# Altium project Conditioning_Chamber_Controller.PrjPcb
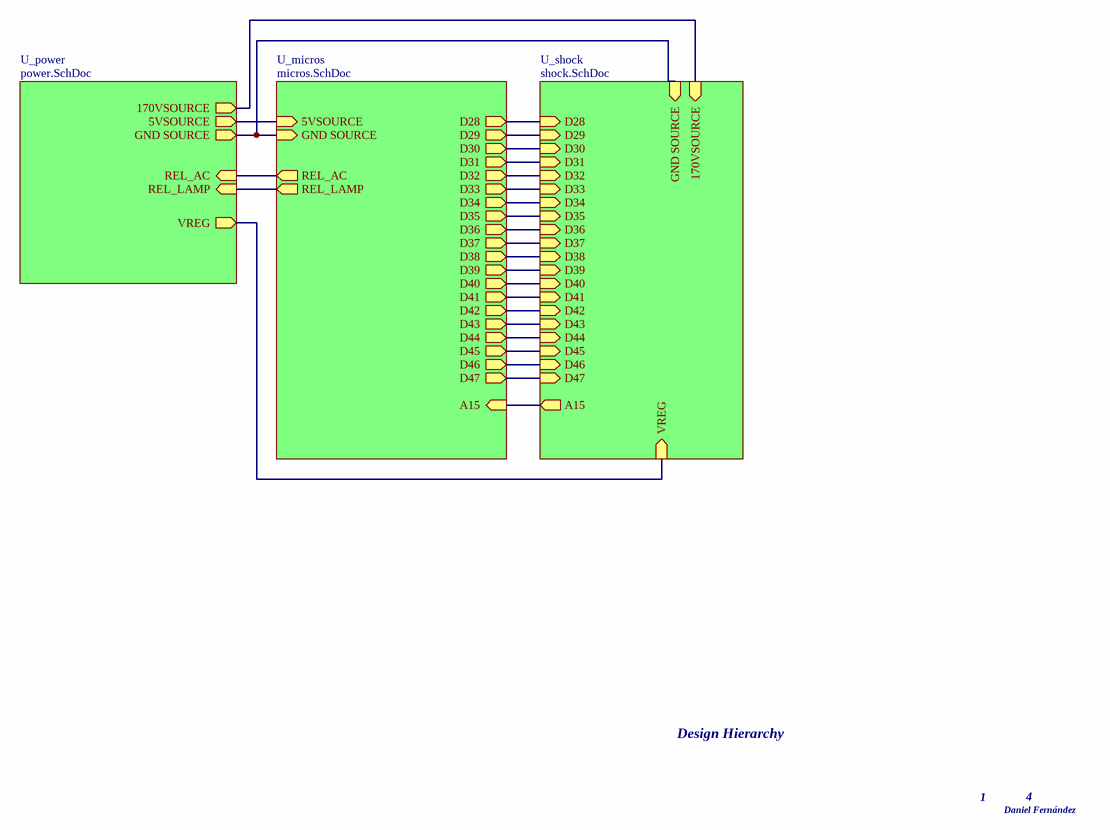
[diagram p0: main.SchDoc]
4 sheets, 83 parts. Net scope: hierarchical (ports join the sheet entries above them; power ports are global).
Board file: main.PcbDoc
Sheets:
  main.SchDoc
    U_power = power.SchDoc
    U_micros = micros.SchDoc
    U_shock = shock.SchDoc

## Sheet main.SchDoc
size Letter

### Sub-sheets
U_micros = micros.SchDoc: GND SOURCE (in), 5VSOURCE (in), REL_AC (out), REL_LAMP (out), D28 (out), D29 (out), D30 (out), D31 (out), D32 (out), D33 (out), D34 (out), D35 (out), D36 (out), D37 (out), D38 (out), D39 (out), D40 (out), D41 (out), D42 (out), D43 (out), D44 (out), D45 (out), D46 (out), D47 (out), A15 (in)
U_power = power.SchDoc: REL_AC (in), REL_LAMP (in), 5VSOURCE (out), 170VSOURCE (out), GND SOURCE (out), VREG (out)
U_shock = shock.SchDoc: D28 (in), GND SOURCE (in), D29 (in), D30 (in), D31 (in), D32 (in), D33 (in), D34 (in), D35 (in), D36 (in), D37 (in), D38 (in), D39 (in), D40 (in), D41 (in), D42 (in), D43 (in), D44 (in), D45 (in), D46 (in), D47 (in), 170VSOURCE (in), A15 (out), VREG (in)

### Nets
+5VDC: sheet U_power/5VSOURCE, sheet U_micros/5VSOURCE
+170VDC: sheet U_power/170VSOURCE, sheet U_shock/170VSOURCE
+VREG: sheet U_power/VREG, sheet U_shock/VREG
GND: sheet U_power/GND SOURCE, sheet U_micros/GND SOURCE, sheet U_shock/GND SOURCE
NetJ11_1: sheet U_micros/A15, sheet U_shock/A15
NetO1_1: sheet U_micros/D28, sheet U_shock/D28
NetO2_1: sheet U_micros/D29, sheet U_shock/D29
NetO3_1: sheet U_micros/D30, sheet U_shock/D30
NetO4_1: sheet U_micros/D31, sheet U_shock/D31
NetO5_1: sheet U_micros/D32, sheet U_shock/D32
NetO6_1: sheet U_micros/D33, sheet U_shock/D33
NetO7_1: sheet U_micros/D34, sheet U_shock/D34
NetO8_1: sheet U_micros/D35, sheet U_shock/D35
NetO9_1: sheet U_micros/D36, sheet U_shock/D36
NetO10_1: sheet U_micros/D37, sheet U_shock/D37
NetO11_1: sheet U_micros/D38, sheet U_shock/D38
NetO12_1: sheet U_micros/D39, sheet U_shock/D39
NetO13_1: sheet U_micros/D40, sheet U_shock/D40
NetO14_1: sheet U_micros/D41, sheet U_shock/D41
NetO15_1: sheet U_micros/D42, sheet U_shock/D42
NetO16_1: sheet U_micros/D43, sheet U_shock/D43
NetO17_1: sheet U_micros/D44, sheet U_shock/D44
NetO18_1: sheet U_micros/D45, sheet U_shock/D45
NetO19_1: sheet U_micros/D46, sheet U_shock/D46
NetO20_1: sheet U_micros/D47, sheet U_shock/D47
NetR3_1: sheet U_power/REL_AC, sheet U_micros/REL_AC
NetR4_1: sheet U_power/REL_LAMP, sheet U_micros/REL_LAMP

### Notes on the sheet
- Design Hierarchy
- 1
- Daniel Fernández
- 4
- Title
- Size:
- Date:
- Letter
- Number:
- Time:
- Revision:
- Sheet
- of
- File:

## Sheet power.SchDoc
size Letter
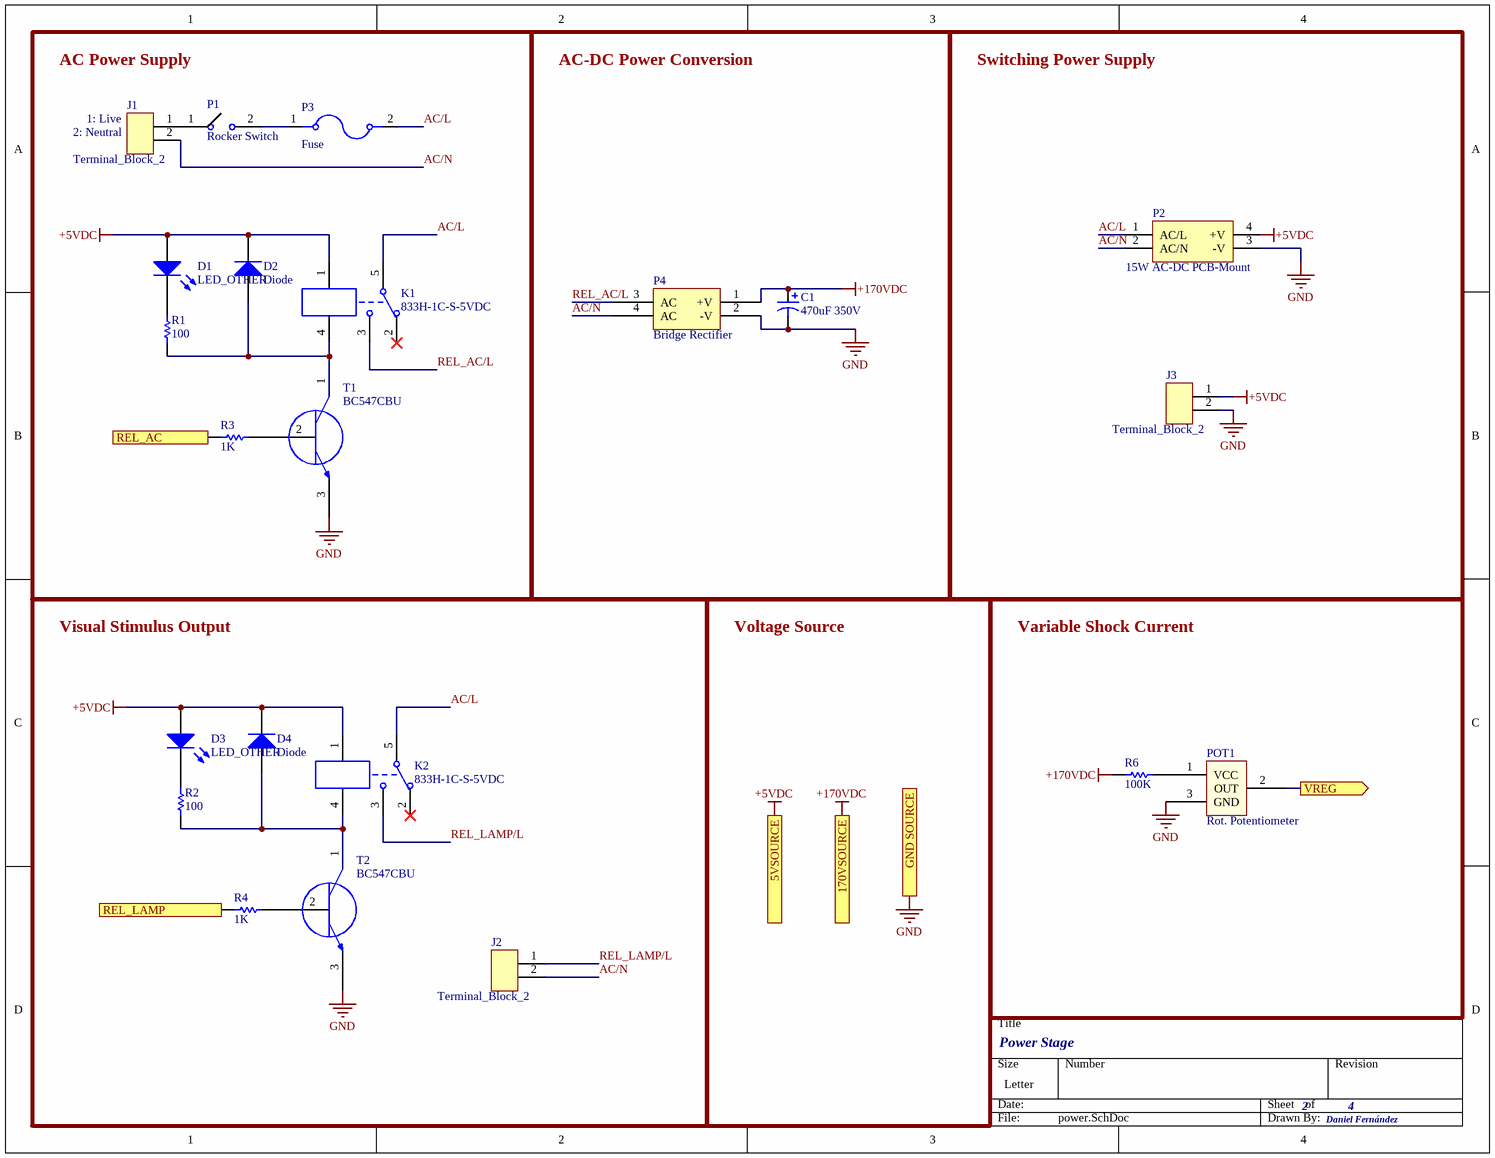
[diagram p1: power.SchDoc]

### Parts
C1  470uF 350V  [ESMQ351VSN471MR35S]
D1  LED_OTHER  [LED_AXIAL]
D2  Diode  [Diodo 1N4007 Rectificador]
D3  LED_OTHER  [LED_AXIAL]
D4  Diode  [Diodo 1N4007 Rectificador]
J1  Terminal_Block_2  [Terminal_Block_2]
J2  Terminal_Block_2  [Terminal_Block_2]
J3  Terminal_Block_2  [Terminal_Block_2]
K1  833H-1C-S-5VDC  [Relay_833H]
K2  833H-1C-S-5VDC  [Relay_833H]
P1  Rocker Switch  [Rocker Switch]
P2  15W AC-DC PCB-Mount  [15W AC-DC PCB-Mount]
P3  Fuse  [Fuse Holder]
P4  Bridge Rectifier  [KBPC1010]
POT1  Rot. Potentiometer  [PTV09A-4020F-B504]
R1  100  [RESISTOR]
R2  100  [RESISTOR]
R3  1K  [RESISTOR]
R4  1K  [RESISTOR]
R6  100K  [RESISTOR]
T1  BC547CBU  [BC547CBU]
T2  BC547CBU  [BC547CBU]

### Blocks framed on the sheet
AC Power Supply: D1 D2 J1 K1 P1 P3 R1 R3 T1
AC-DC Power Conversion: C1 P4
Switching Power Supply: J3 P2
Visual Stimulus Output: D3 D4 J2 K2 R2 R4 T2
Variable Shock Current: POT1 R6

### Ports
5VSOURCE (out), 170VSOURCE (out), GND SOURCE (out), REL_AC (in), REL_LAMP (in), VREG (out)

### Nets
+5VDC: D1.1(A) D2.2(C) D3.1(A) D4.2(C) J3.1 K1.1 K2.1 P2.4(+V) ; port 5VSOURCE
+170VDC: C1.1 P4.1(+V) R6.1 ; port 170VSOURCE
+VREG: POT1.2(OUT) ; port VREG
GND: C1.2 J3.2 P2.3(-V) P4.2(-V) POT1.3(GND) T1.3(E) T2.3(E) ; port GND SOURCE
AC/L: K1.5 K2.5 P2.1(AC/L) P3.2
AC/N: J1.2 J2.2 P2.2(AC/N) P4.4(AC)
REL_AC/L: K1.3(NO) P4.3(AC)
REL_LAMP/L: J2.1 K2.3(NO)
NetD1_2: D1.2(K) R1.2
NetD2_1: D2.1(A) K1.4 R1.1 T1.1(C)
NetD3_2: D3.2(K) R2.2
NetD4_1: D4.1(A) K2.4 R2.1 T2.1(C)
NetJ1_1: J1.1 P1.1
NetP1_2: P1.2 P3.1
NetPOT1_1: POT1.1(VCC) R6.2
NetR3_1: R3.1 ; port REL_AC
NetR3_2: R3.2 T1.2(B)
NetR4_1: R4.1 ; port REL_LAMP
NetR4_2: R4.2 T2.2(B)

Not connected (* = marked no-connect by the designer): K1 2(NC)*; K2 2(NC)*

### Notes on the sheet
- (near J1) 2: Neutral
- (near J1) 1: Live
- Voltage Source
- Power Stage
- 2
- Daniel Fernández
- 4
- Title
- Size:
- Date:
- Letter
- Number:
- Time:
- Revision:
- Sheet
- of
- File:

### Library data of the parts
C1 = Capacitor_AXIAL_Pol: Manufacturer: *; Manufacturer Code: *
D1 D3 = LED_OTHER: Typical RED GaAs LED; Published: 8-Jun-2000; LatestRevisionDate: 08-Jul-2005; LatestRevisionNote: Mech Layer 1 removed.; PackageReference: LED-1; Publisher: Altium Limited; PackageDescription: LED; 2 Leads
D2 D4 = Diode: Default Diode; Published: 8-Jun-2000; LatestRevisionDate: 17-Jul-2002; LatestRevisionNote: Re-released for DXP Platform.; PackageVersion: Sep-1996; PackageReference: SMC; Publisher: Altium Limited; PackageDescription: DO-214-AB/SMC; 2 C-Bend Leads; Body 7.9 x 5.9 mm, inc. leads (LxW); Code_JEDEC: DO-214-AB
K1 K2 = Relay_Song 5V: Relay Song Chuan 5V; Manufacturer: Song Chuan; Manufacturer Code: 833H-1C-S-5VDC; HelpURL: C:\Varios\PERCRO_DATASHEET\Relay_833H.pdf
P4 = KBPC1010: Single-Phase Silicon Bridge Rectifier Rectifier
POT1 = ROT_POT: Rotatory Potentiometer
R1-R4 R6 = Resistor_Axial: Published: 8-Jun-2000; LatestRevisionDate: 17-Jul-2002; LatestRevisionNote: Re-released for DXP Platform.; PackageReference: AXIAL-0.3; Publisher: Altium Limited; PackageDescription: Axial Device, Thru-Hole; 2 Leads; 0.3 in Pin Spacing

## Sheet micros.SchDoc: Microcontrollers Stage
size Letter; Author: Daniel Fernández; CompanyName: UAEMéx; DrawnBy: Daniel Fernández; Engineer: Daniel Fernández; Organization: UAEMéx; SheetNumber: 2; SheetTotal: 3; ImagePath: C:\Users\xsteg\Desktop\Logo_de_la_UAEMex.svg
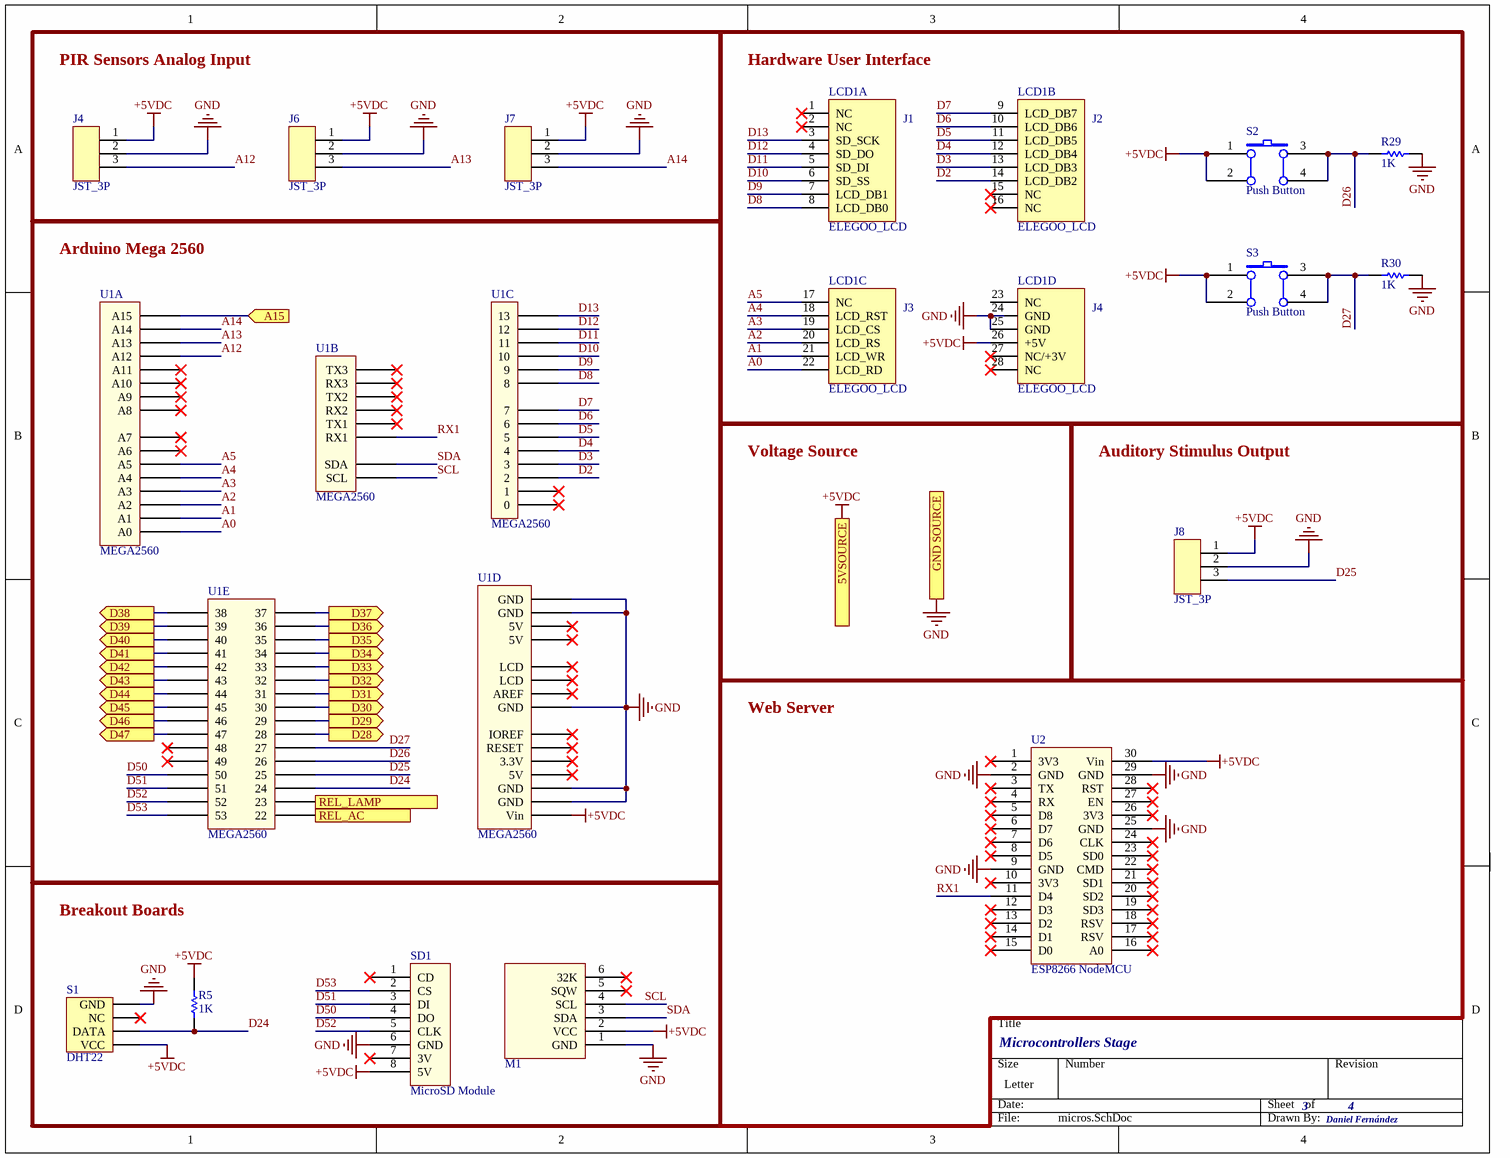
[diagram p2: micros.SchDoc]

### Parts
J4  JST_3P  [JST_3P_ANGLE]
J6  JST_3P  [JST_3P_ANGLE]
J7  JST_3P  [JST_3P_ANGLE]
J8  JST_3P  [JST_3P_ANGLE]
LCD1  ELEGOO_LCD  [Elegoo_LCD]  (parts A,B,C,D of 4)
M1  DS3231  [DS3231_HORIZONTAL]  (value not drawn)
R5  1K  [RESISTOR]
R29  1K  [RESISTOR]
R30  1K  [RESISTOR]
S1  DHT22  [DHT22]
S2  Push Button  [PUSH_BUTTON]
S3  Push Button  [PUSH_BUTTON]
SD1  MicroSD Module  [Micro-SD]
U1  MEGA2560  [MEGA2560_Inv]  (parts A,B,C,D,E of 5)
U2  ESP8266 NodeMCU  [ESP8266_NodeMCU]

### Blocks framed on the sheet
PIR Sensors Analog Input: J4 J6 J7
Hardware User Interface: LCD1 R29 R30 S2 S3
Arduino Mega 2560: U1
Auditory Stimulus Output: J8
Breakout Boards: M1 R5 S1 SD1

### Ports
5VSOURCE (in), A15 (in), D28 (out), D29 (out), D30 (out), D31 (out), D32 (out), D33 (out), D34 (out), D35 (out), D36 (out), D37 (out), D38 (out), D39 (out), D40 (out), D41 (out), D42 (out), D43 (out), D44 (out), D45 (out), D46 (out), D47 (out), GND SOURCE (in), REL_AC (out), REL_LAMP (out)

### Nets
+5VDC: J4.1 J6.1 J7.1 J8.1 LCD1.26(+5V) M1.2(VCC) R5.1 S1.1(VCC) S2.1 S2.2 S3.1 S3.2 SD1.8(5V) U1.Vin U2.30(Vin) ; port 5VSOURCE
GND: J4.2 J6.2 J7.2 J8.2 LCD1.24(GND) LCD1.25(GND) M1.1(GND) R29.2 R30.2 S1.4(GND) SD1.6(GND) U1.GND U1.GND_1(GND) U1.GND_2(GND) U1.GND_3(GND) U1.GND_4(GND) U2.2(GND) U2.9(GND) U2.25(GND) U2.29(GND) ; port GND SOURCE
A0: LCD1.22(LCD_RD) U1.A0
A1: LCD1.21(LCD_WR) U1.A1
A2: LCD1.20(LCD_RS) U1.A2
A3: LCD1.19(LCD_CS) U1.A3
A4: LCD1.18(LCD_RST) U1.A4
A5: LCD1.17(NC) U1.A5
A12: J4.3 U1.A12
A13: J6.3 U1.A13
A14: J7.3 U1.A14
D2: LCD1.14(LCD_DB2) U1.2
D3: LCD1.13(LCD_DB3) U1.3
D4: LCD1.12(LCD_DB4) U1.4
D5: LCD1.11(LCD_DB5) U1.5
D6: LCD1.10(LCD_DB6) U1.6
D7: LCD1.9(LCD_DB7) U1.7
D8: LCD1.8(LCD_DB0) U1.8
D9: LCD1.7(LCD_DB1) U1.9
D10: LCD1.6(SD_SS) U1.10
D11: LCD1.5(SD_DI) U1.11
D12: LCD1.4(SD_DO) U1.12
D13: LCD1.3(SD_SCK) U1.13
D24: R5.2 S1.2(DATA) U1.24
D25: J8.3 U1.25
D26: R29.1 S2.3 S2.4 U1.26
D27: R30.1 S3.3 S3.4 U1.27
D50: SD1.4(DO) U1.50
D51: SD1.3(DI) U1.51
D52: SD1.5(CLK) U1.52
D53: SD1.2(CS) U1.53
RX1: U1.RX1 U2.11(D4)
SCL: M1.4(SCL) U1.SCL
SDA: M1.3(SDA) U1.SDA
NetJ11_1: U1.A15 ; port A15
NetO1_1: U1.28 ; port D28
NetO2_1: U1.29 ; port D29
NetO3_1: U1.30 ; port D30
NetO4_1: U1.31 ; port D31
NetO5_1: U1.32 ; port D32
NetO6_1: U1.33 ; port D33
NetO7_1: U1.34 ; port D34
NetO8_1: U1.35 ; port D35
NetO9_1: U1.36 ; port D36
NetO10_1: U1.37 ; port D37
NetO11_1: U1.38 ; port D38
NetO12_1: U1.39 ; port D39
NetO13_1: U1.40 ; port D40
NetO14_1: U1.41 ; port D41
NetO15_1: U1.42 ; port D42
NetO16_1: U1.43 ; port D43
NetO17_1: U1.44 ; port D44
NetO18_1: U1.45 ; port D45
NetO19_1: U1.46 ; port D46
NetO20_1: U1.47 ; port D47
NetR3_1: U1.22 ; port REL_AC
NetR4_1: U1.23 ; port REL_LAMP

Not connected (* = marked no-connect by the designer): LCD1 1(NC)* 2(NC)* 15(NC)* 16(NC)* 23(NC) 27(NC/+3V)* 28(NC)*; M1 5(SQW)* 6(32K)*; S1 3(NC)*; SD1 1(CD)* 7(3V)*; U1 0* 1* 3.3V* 5V* 5V_1(5V)* 5V_2(5V)* 48* 49* A6* A7* A8* A9* A10* A11* AREF* IOREF* LCD* LCD_1(LCD)* RESET* RX2* RX3* TX1* TX2* TX3*; U2 1(3V3)* 3(TX)* 4(RX)* 5(D8)* 6(D7)* 7(D6)* 8(D5)* 10(3V3)* 12(D3)* 13(D2)* 14(D1)* 15(D0)* 16(A0)* 17(RSV)* 18(RSV)* 19(SD3)* 20(SD2)* 21(SD1)* 22(CMD)* 23(SD0)* 24(CLK)* 26(3V3)* 27(EN)* 28(RST)*

### Notes on the sheet
- Voltage Source
- Web Server
- Microcontrollers Stage
- 3
- Daniel Fernández
- 4
- Title
- Size:
- Date:
- Letter
- Number:
- Time:
- Revision:
- Sheet
- of
- File:
- (in symbol ELEGOO_LCD_2.8, part A) J1
- (in symbol ELEGOO_LCD_2.8, part B) J2
- (in symbol ELEGOO_LCD_2.8, part C) J3
- (in symbol ELEGOO_LCD_2.8, part D) J4

### Library data of the parts
LCD1 = ELEGOO_LCD_2.8: LCD 2.8 in - 5 V; Manufacturer: ELEGOO; Manufacturer Code: Elego_LCD_2.8in; Value: 5V - LCD; HelpURL: C:\Varios\PERCRO_DATASHEET\Elegoo 2.8 inch.pdf
M1 = DS3231: RTC MODULE
R5 R29 R30 = Resistor_Axial: Published: 8-Jun-2000; LatestRevisionDate: 17-Jul-2002; LatestRevisionNote: Re-released for DXP Platform.; PackageReference: AXIAL-0.3; Publisher: Altium Limited; PackageDescription: Axial Device, Thru-Hole; 2 Leads; 0.3 in Pin Spacing
S1 = DHT22: Sensor de humedad y temperatura; Manufacturer: Aosong Electronics; Manufacturer Code: DHT22; Height: 25.3 mm; HelpURL: C:\Varios\PERCRO_DATASHEET\DHT22.pdf
S2 S3 = Push_Button_4Pin
SD1 = Micro-SD: Adafruit Micro SD Card Breakout Board
U1 = MEGA2560: Arduino Mega2560
U2 = ESP8266: NODEMCU V2 ESP8266

## Sheet shock.SchDoc
size Letter
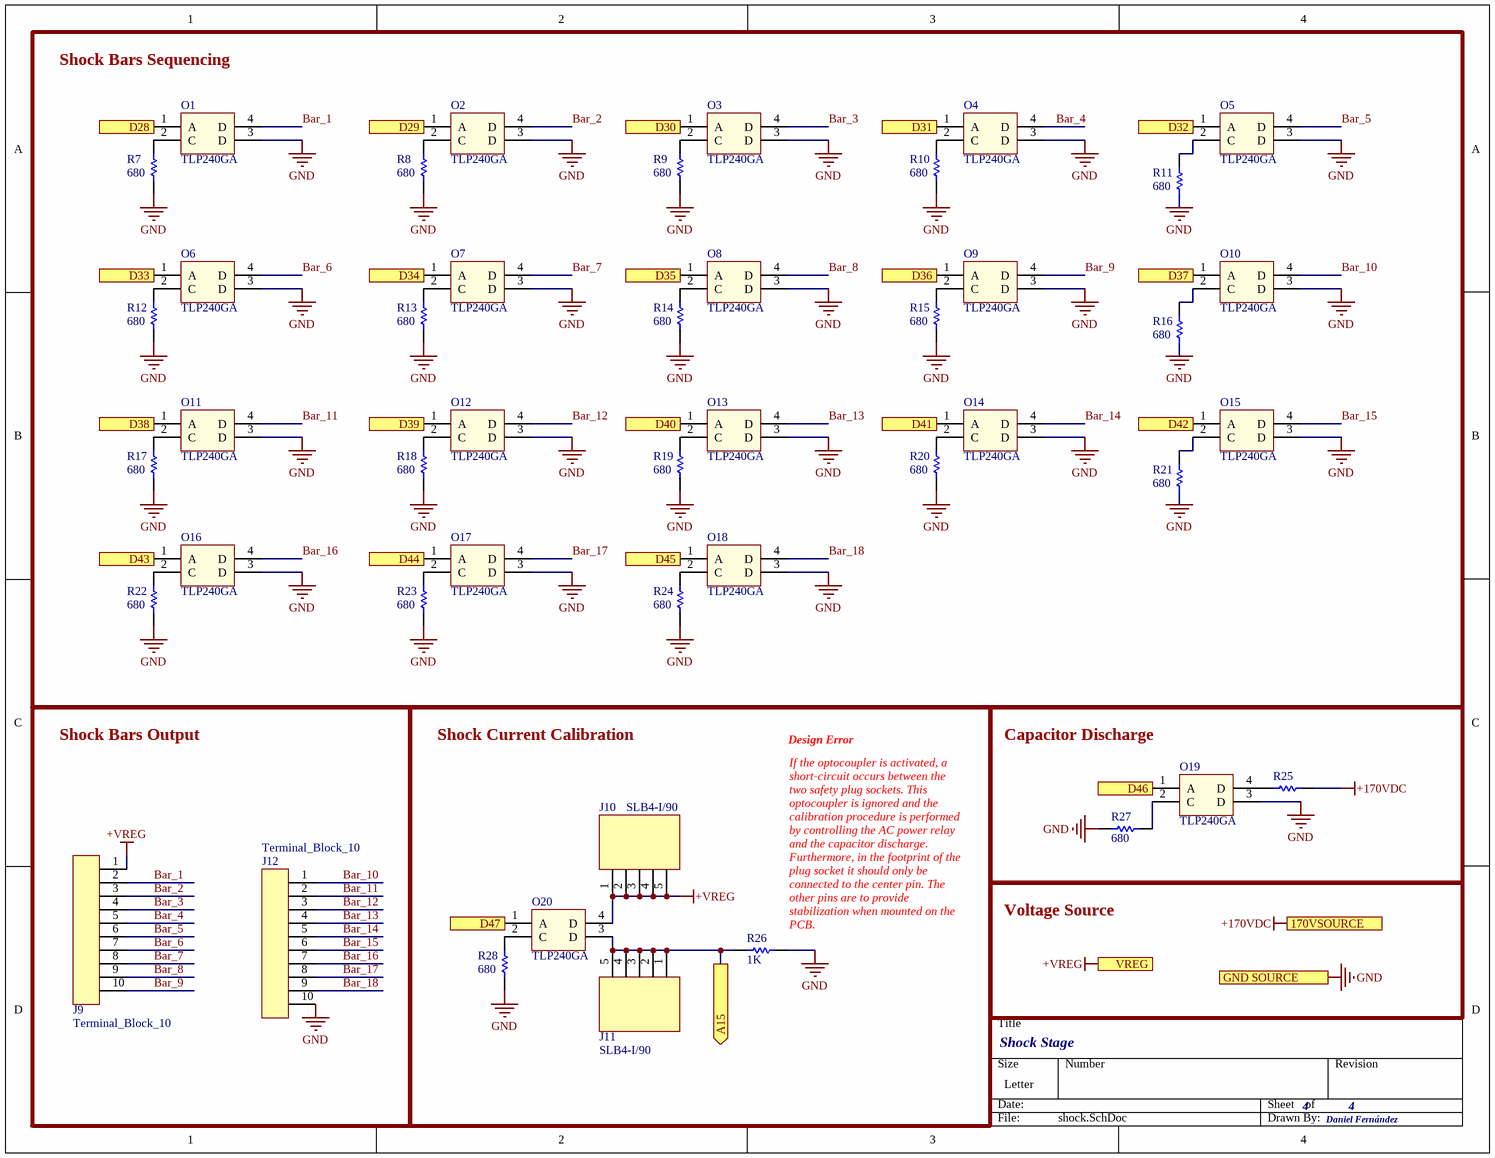
[diagram p3: shock.SchDoc]

### Parts
J9  Terminal_Block_10  [Terminal_Block_10]
J10  SLB4-I/90  [SLB4-I/90]
J11  SLB4-I/90  [SLB4-I/90]
J12  Terminal_Block_10  [Terminal_Block_10]
O1  TLP240GA  [TLP240GA]
O2  TLP240GA  [TLP240GA]
O3  TLP240GA  [TLP240GA]
O4  TLP240GA  [TLP240GA]
O5  TLP240GA  [TLP240GA]
O6  TLP240GA  [TLP240GA]
O7  TLP240GA  [TLP240GA]
O8  TLP240GA  [TLP240GA]
O9  TLP240GA  [TLP240GA]
O10  TLP240GA  [TLP240GA]
O11  TLP240GA  [TLP240GA]
O12  TLP240GA  [TLP240GA]
O13  TLP240GA  [TLP240GA]
O14  TLP240GA  [TLP240GA]
O15  TLP240GA  [TLP240GA]
O16  TLP240GA  [TLP240GA]
O17  TLP240GA  [TLP240GA]
O18  TLP240GA  [TLP240GA]
O19  TLP240GA  [TLP240GA]
O20  TLP240GA  [TLP240GA]
R7  680  [RESISTOR]
R8  680  [RESISTOR]
R9  680  [RESISTOR]
R10  680  [RESISTOR]
R11  680  [RESISTOR]
R12  680  [RESISTOR]
R13  680  [RESISTOR]
R14  680  [RESISTOR]
R15  680  [RESISTOR]
R16  680  [RESISTOR]
R17  680  [RESISTOR]
R18  680  [RESISTOR]
R19  680  [RESISTOR]
R20  680  [RESISTOR]
R21  680  [RESISTOR]
R22  680  [RESISTOR]
R23  680  [RESISTOR]
R24  680  [RESISTOR]
R25  Ceramic Resistor  [AXIAL_CERAMIC_RESISTOR]  (value not drawn)
R26  1K  [RESISTOR]
R27  680  [RESISTOR]
R28  680  [RESISTOR]

### Blocks framed on the sheet
Shock Bars Sequencing: O1-O18 R7-R24
Shock Bars Output: J9 J12
Shock Current Calibration: J10 J11 O20 R26 R28
Capacitor Discharge: O19 R25 R27

### Ports
170VSOURCE (in), A15 (out), D28 (in), D29 (in), D30 (in), D31 (in), D32 (in), D33 (in), D34 (in), D35 (in), D36 (in), D37 (in), D38 (in), D39 (in), D40 (in), D41 (in), D42 (in), D43 (in), D44 (in), D45 (in), D46 (in), D47 (in), GND SOURCE (in), VREG (in)

### Nets
+170VDC: R25.2 ; port 170VSOURCE
+VREG: J9.1 J10.1 J10.2(Vin) J10.3(Vin) J10.4(Vin) J10.5(Vin) O20.4(D) ; port VREG
GND: J12.10 O1.3(D) O2.3(D) O3.3(D) O4.3(D) O5.3(D) O6.3(D) O7.3(D) O8.3(D) O9.3(D) O10.3(D) O11.3(D) O12.3(D) O13.3(D) O14.3(D) O15.3(D) O16.3(D) O17.3(D) O18.3(D) O19.3(D) R7.1 R8.1 R9.1 R10.1 R11.1 R12.1 R13.1 R14.1 R15.1 R16.1 R17.1 R18.1 R19.1 R20.1 R21.1 R22.1 R23.1 R24.1 R26.2 R27.1 R28.1 ; port GND SOURCE
Bar_1: J9.2 O1.4(D)
Bar_2: J9.3 O2.4(D)
Bar_3: J9.4 O3.4(D)
Bar_4: J9.5 O4.4(D)
Bar_5: J9.6 O5.4(D)
Bar_6: J9.7 O6.4(D)
Bar_7: J9.8 O7.4(D)
Bar_8: J9.9 O8.4(D)
Bar_9: J9.10 O9.4(D)
Bar_10: J12.1 O10.4(D)
Bar_11: J12.2 O11.4(D)
Bar_12: J12.3 O12.4(D)
Bar_13: J12.4 O13.4(D)
Bar_14: J12.5 O14.4(D)
Bar_15: J12.6 O15.4(D)
Bar_16: J12.7 O16.4(D)
Bar_17: J12.8 O17.4(D)
Bar_18: J12.9 O18.4(D)
NetJ11_1: J11.1 J11.2(Vin) J11.3(Vin) J11.4(Vin) J11.5(Vin) O20.3(D) R26.1 ; port A15
NetO1_1: O1.1(A) ; port D28
NetO1_2: O1.2(C) R7.2
NetO2_1: O2.1(A) ; port D29
NetO2_2: O2.2(C) R8.2
NetO3_1: O3.1(A) ; port D30
NetO3_2: O3.2(C) R9.2
NetO4_1: O4.1(A) ; port D31
NetO4_2: O4.2(C) R10.2
NetO5_1: O5.1(A) ; port D32
NetO5_2: O5.2(C) R11.2
NetO6_1: O6.1(A) ; port D33
NetO6_2: O6.2(C) R12.2
NetO7_1: O7.1(A) ; port D34
NetO7_2: O7.2(C) R13.2
NetO8_1: O8.1(A) ; port D35
NetO8_2: O8.2(C) R14.2
NetO9_1: O9.1(A) ; port D36
NetO9_2: O9.2(C) R15.2
NetO10_1: O10.1(A) ; port D37
NetO10_2: O10.2(C) R16.2
NetO11_1: O11.1(A) ; port D38
NetO11_2: O11.2(C) R17.2
NetO12_1: O12.1(A) ; port D39
NetO12_2: O12.2(C) R18.2
NetO13_1: O13.1(A) ; port D40
NetO13_2: O13.2(C) R19.2
NetO14_1: O14.1(A) ; port D41
NetO14_2: O14.2(C) R20.2
NetO15_1: O15.1(A) ; port D42
NetO15_2: O15.2(C) R21.2
NetO16_1: O16.1(A) ; port D43
NetO16_2: O16.2(C) R22.2
NetO17_1: O17.1(A) ; port D44
NetO17_2: O17.2(C) R23.2
NetO18_1: O18.1(A) ; port D45
NetO18_2: O18.2(C) R24.2
NetO19_1: O19.1(A) ; port D46
NetO19_2: O19.2(C) R27.2
NetO19_4: O19.4(D) R25.1
NetO20_1: O20.1(A) ; port D47
NetO20_2: O20.2(C) R28.2

### Notes on the sheet
- Design Error
- Voltage Source
- (near R26) If the optocoupler is activated, a short-circuit occurs between the two safety plug sockets. This optocoupler is ignored and the calibration procedure is performed by controlling the AC power relay and the capacitor discharge. Furthermore, in the footprint of the plug socket it should only be connected to the center pin. The other pins are to provide stabilization when mounted on the PCB.
- Shock Stage
- 4
- Daniel Fernández
- Title
- Size:
- Date:
- Letter
- Number:
- Time:
- Revision:
- Sheet
- of
- File:

### Library data of the parts
O1-O20 = TLP240GA: Photorelay
R7-R24 R26-R28 = Resistor_Axial: Published: 8-Jun-2000; LatestRevisionDate: 17-Jul-2002; LatestRevisionNote: Re-released for DXP Platform.; PackageReference: AXIAL-0.3; Publisher: Altium Limited; PackageDescription: Axial Device, Thru-Hole; 2 Leads; 0.3 in Pin Spacing
R25 = AXIAL_CERAMIC_RESISTOR

## Nets that join several sheets
+5VDC: power (8 pins), micros (15 pins)
+170VDC: power (C1.1 P4.1 R6.1), shock (R25.2)
+VREG: power (POT1.2), shock (7 pins)
GND: power (7 pins), micros (20 pins), shock (41 pins)
NetJ11_1: micros (U1.A15), shock (7 pins)
NetO1_1: micros (U1.28), shock (O1.1)
NetO2_1: micros (U1.29), shock (O2.1)
NetO3_1: micros (U1.30), shock (O3.1)
NetO4_1: micros (U1.31), shock (O4.1)
NetO5_1: micros (U1.32), shock (O5.1)
NetO6_1: micros (U1.33), shock (O6.1)
NetO7_1: micros (U1.34), shock (O7.1)
NetO8_1: micros (U1.35), shock (O8.1)
NetO9_1: micros (U1.36), shock (O9.1)
NetO10_1: micros (U1.37), shock (O10.1)
NetO11_1: micros (U1.38), shock (O11.1)
NetO12_1: micros (U1.39), shock (O12.1)
NetO13_1: micros (U1.40), shock (O13.1)
NetO14_1: micros (U1.41), shock (O14.1)
NetO15_1: micros (U1.42), shock (O15.1)
NetO16_1: micros (U1.43), shock (O16.1)
NetO17_1: micros (U1.44), shock (O17.1)
NetO18_1: micros (U1.45), shock (O18.1)
NetO19_1: micros (U1.46), shock (O19.1)
NetO20_1: micros (U1.47), shock (O20.1)
NetR3_1: power (R3.1), micros (U1.22)
NetR4_1: power (R4.1), micros (U1.23)